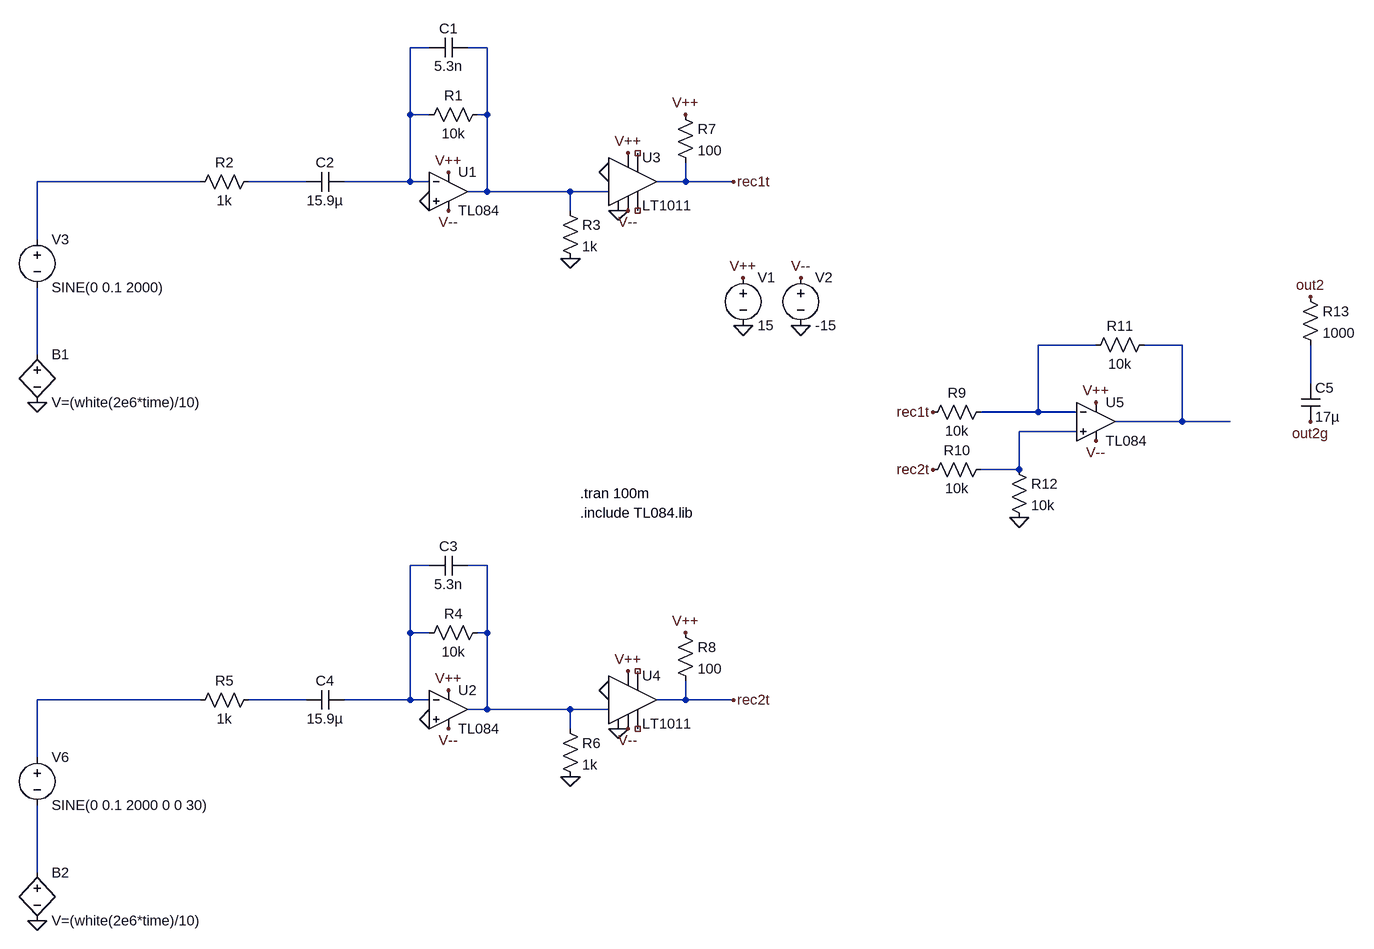
[diagram p0: schematic Draft1.asc]
Draft1.asc, the LTspice schematic file:
Version 4
SHEET 1 2948 1224
WIRE 32 -432 0 -432
WIRE 128 -432 96 -432
WIRE 0 -320 0 -432
WIRE 32 -320 0 -320
WIRE 128 -320 128 -432
WIRE 128 -320 112 -320
WIRE -368 -208 -640 -208
WIRE -192 -208 -288 -208
WIRE 0 -208 0 -320
WIRE 0 -208 -128 -208
WIRE 32 -208 0 -208
WIRE 464 -208 464 -240
WIRE 464 -208 416 -208
WIRE 544 -208 464 -208
WIRE 128 -192 128 -320
WIRE 128 -192 96 -192
WIRE 272 -192 128 -192
WIRE 336 -192 272 -192
WIRE 272 -160 272 -192
WIRE -640 -112 -640 -208
WIRE 1568 64 1472 64
WIRE 1712 64 1648 64
WIRE -640 80 -640 -32
WIRE 2864 128 2864 64
WIRE 1472 176 1472 64
WIRE 1472 176 1376 176
WIRE 1536 176 1472 176
WIRE 1712 192 1712 64
WIRE 1712 192 1600 192
WIRE 1792 192 1712 192
WIRE 1536 208 1440 208
WIRE 1440 272 1440 208
WIRE 1440 272 1376 272
WIRE 32 432 0 432
WIRE 128 432 96 432
WIRE 0 544 0 432
WIRE 32 544 0 544
WIRE 128 544 128 432
WIRE 128 544 112 544
WIRE -368 656 -640 656
WIRE -192 656 -288 656
WIRE 0 656 0 544
WIRE 0 656 -128 656
WIRE 32 656 0 656
WIRE 464 656 464 624
WIRE 464 656 416 656
WIRE 544 656 464 656
WIRE 128 672 128 544
WIRE 128 672 96 672
WIRE 272 672 128 672
WIRE 336 672 272 672
WIRE 272 704 272 672
WIRE -640 752 -640 656
WIRE -640 944 -640 832
FLAG 560 -48 V++
FLAG 656 -48 V--
FLAG 64 -160 V--
FLAG 64 -224 V++
FLAG 64 704 V--
FLAG 64 640 V++
FLAG 368 -256 V++
FLAG 368 -160 V--
FLAG 368 608 V++
FLAG 368 704 V--
FLAG 464 -320 V++
FLAG 464 544 V++
FLAG 1568 160 V++
FLAG 1568 224 V--
FLAG 2864 192 out2g
FLAG 2864 -16 out2
FLAG 1296 176 rec1t
FLAG 1296 272 rec2t
FLAG 544 -208 rec1t
FLAG 544 656 rec2t
FLAG 1440 352 0
FLAG 560 32 0
FLAG 656 32 0
FLAG 272 -80 0
FLAG 32 -176 0
FLAG 32 688 0
FLAG -640 1024 0
FLAG -640 160 0
FLAG 352 -160 0
FLAG 352 704 0
FLAG 272 784 0
FLAG 336 -224 0
FLAG 336 640 0
SYMBOL res 128 -336 R90
WINDOW 0 0 56 VBottom 2
WINDOW 3 32 56 VTop 2
SYMATTR InstName R1
SYMATTR Value 10k
SYMBOL cap 96 -448 R90
WINDOW 0 0 32 VBottom 2
WINDOW 3 32 32 VTop 2
SYMATTR InstName C1
SYMATTR Value 5.3n
SYMBOL cap -128 -224 R90
WINDOW 0 0 32 VBottom 2
WINDOW 3 32 32 VTop 2
SYMATTR InstName C2
SYMATTR Value 15.9µ
SYMBOL res -272 -224 R90
WINDOW 0 0 56 VBottom 2
WINDOW 3 32 56 VTop 2
SYMATTR InstName R2
SYMATTR Value 1k
SYMBOL Opamps\\opamp2 64 -256 R0
SYMATTR InstName U1
SYMATTR Value TL084
SYMBOL voltage 560 -64 R0
SYMATTR InstName V1
SYMATTR Value 15
SYMBOL voltage 656 -64 R0
SYMATTR InstName V2
SYMATTR Value -15
SYMBOL voltage -640 -128 R0
WINDOW 123 0 0 Left 0
WINDOW 39 0 0 Left 0
SYMATTR InstName V3
SYMATTR Value SINE(0 0.1 2000)
SYMBOL res 256 -176 R0
SYMATTR InstName R3
SYMATTR Value 1k
SYMBOL bv -640 64 R0
SYMATTR InstName B1
SYMATTR Value V=(white(2e6*time)/10)
SYMBOL res 128 528 R90
WINDOW 0 0 56 VBottom 2
WINDOW 3 32 56 VTop 2
SYMATTR InstName R4
SYMATTR Value 10k
SYMBOL cap 96 416 R90
WINDOW 0 0 32 VBottom 2
WINDOW 3 32 32 VTop 2
SYMATTR InstName C3
SYMATTR Value 5.3n
SYMBOL cap -128 640 R90
WINDOW 0 0 32 VBottom 2
WINDOW 3 32 32 VTop 2
SYMATTR InstName C4
SYMATTR Value 15.9µ
SYMBOL res -272 640 R90
WINDOW 0 0 56 VBottom 2
WINDOW 3 32 56 VTop 2
SYMATTR InstName R5
SYMATTR Value 1k
SYMBOL Opamps\\opamp2 64 608 R0
SYMATTR InstName U2
SYMATTR Value TL084
SYMBOL voltage -640 736 R0
WINDOW 123 0 0 Left 0
WINDOW 39 0 0 Left 0
SYMATTR InstName V6
SYMATTR Value SINE(0 0.1 2000 0 0 30)
SYMBOL res 256 688 R0
SYMATTR InstName R6
SYMATTR Value 1k
SYMBOL bv -640 928 R0
SYMATTR InstName B2
SYMATTR Value V=(white(2e6*time)/10)
SYMBOL Comparators\\LT1011 368 -208 R0
SYMATTR InstName U3
SYMBOL Comparators\\LT1011 368 656 R0
SYMATTR InstName U4
SYMBOL res 448 -336 R0
SYMATTR InstName R7
SYMATTR Value 100
SYMBOL res 448 528 R0
SYMATTR InstName R8
SYMATTR Value 100
SYMBOL Opamps\\opamp2 1568 128 R0
SYMATTR InstName U5
SYMATTR Value TL084
SYMBOL res 1392 160 R90
WINDOW 0 0 56 VBottom 2
WINDOW 3 32 56 VTop 2
SYMATTR InstName R9
SYMATTR Value 10k
SYMBOL res 1392 256 R90
WINDOW 0 0 56 VBottom 2
WINDOW 3 32 56 VTop 2
SYMATTR InstName R10
SYMATTR Value 10k
SYMBOL res 1664 48 R90
WINDOW 0 0 56 VBottom 2
WINDOW 3 32 56 VTop 2
SYMATTR InstName R11
SYMATTR Value 10k
SYMBOL res 1424 256 R0
SYMATTR InstName R12
SYMATTR Value 10k
SYMBOL res 2848 -32 R0
SYMATTR InstName R13
SYMATTR Value 1000
SYMBOL cap 2848 128 R0
SYMATTR InstName C5
SYMATTR Value 17µ
TEXT 288 344 Left 2 !.include TL084.lib
TEXT 288 312 Left 2 !.tran 100m

The netlist it stands for:
* Draft1.asc
R1 N002 N001 10k
C1 N002 N001 5.3n
C2 N001 N004 15.9µ
R2 N004 N003 1k
XU1 0 N001 V++ V-- N002 TL084  ; pins In+ In- V+ V- OUT
V1 V++ 0 15
V2 V-- 0 -15
V3 N003 N007 SINE(0 0.1 2000)
R3 N002 0 1k
B1 N007 0 V=(white(2e6*time)/10)
R4 N011 N010 10k
C3 N011 N010 5.3n
C4 N010 N013 15.9µ
R5 N013 N012 1k
XU2 0 N010 V++ V-- N011 TL084  ; pins In+ In- V+ V- OUT
V6 N012 N014 SINE(0 0.1 2000 0 0 30)
R6 N011 0 1k
B2 N014 0 V=(white(2e6*time)/10)
XU3 0 N002 0 V-- NC_01 NC_02 rec1t V++ LT1011
XU4 0 N011 0 V-- NC_03 NC_04 rec2t V++ LT1011
R7 V++ rec1t 100
R8 V++ rec2t 100
XU5 N009 N005 V++ V-- N006 TL084  ; pins In+ In- V+ V- OUT
R9 N005 rec1t 10k
R10 N009 rec2t 10k
R11 N006 N005 10k
R12 N009 0 10k
R13 out2 N008 1000
C5 N008 out2g 17µ
.include TL084.lib
.tran 100m
.lib LTC1.lib
.backanno
.end